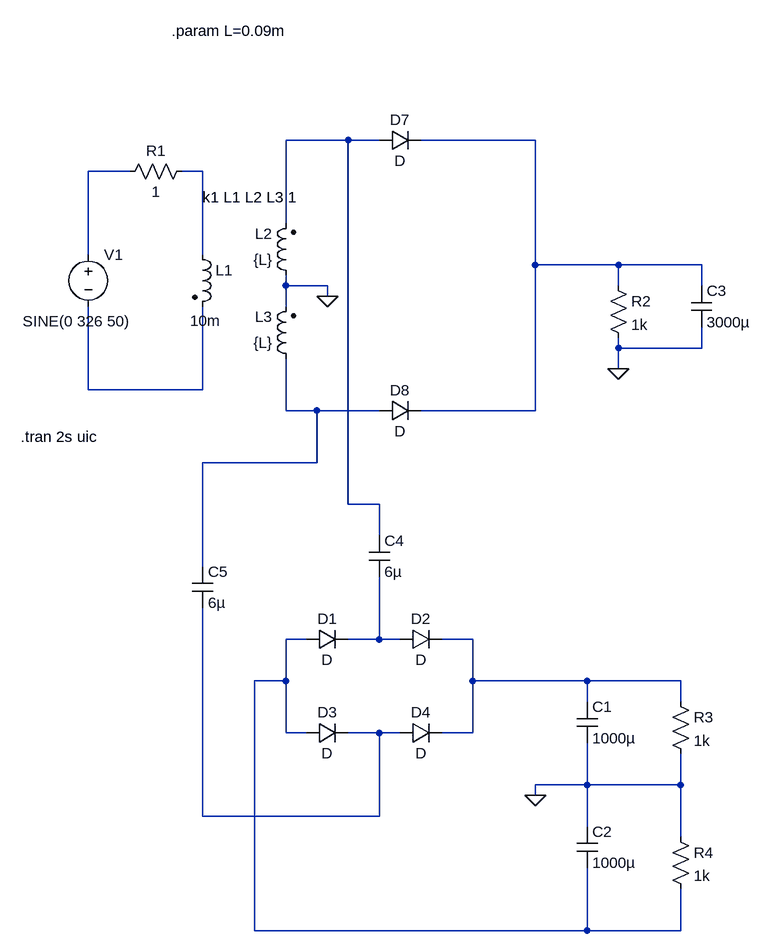
[diagram p0: schematic Dual power supply.asc]
Dual power supply.asc, the LTspice schematic file:
Version 4
SHEET 1 2548 1188
WIRE 304 -48 208 -48
WIRE 352 -48 304 -48
WIRE 592 -48 416 -48
WIRE -32 0 -96 0
WIRE 80 0 48 0
WIRE 208 80 208 -48
WIRE -96 128 -96 0
WIRE 80 128 80 0
WIRE 592 144 592 -48
WIRE 720 144 592 144
WIRE 848 144 720 144
WIRE 208 176 208 160
WIRE 272 176 208 176
WIRE 720 176 720 144
WIRE 848 176 848 144
WIRE 272 192 272 176
WIRE 208 208 208 176
WIRE 720 272 720 256
WIRE 848 272 848 240
WIRE 848 272 720 272
WIRE 720 304 720 272
WIRE -96 336 -96 208
WIRE 80 336 80 208
WIRE 80 336 -96 336
WIRE 208 368 208 288
WIRE 256 368 208 368
WIRE 352 368 256 368
WIRE 592 368 592 144
WIRE 592 368 416 368
WIRE 256 448 256 368
WIRE 256 448 80 448
WIRE 304 512 304 -48
WIRE 352 512 304 512
WIRE 352 560 352 512
WIRE 80 608 80 448
WIRE 240 720 208 720
WIRE 352 720 352 624
WIRE 352 720 304 720
WIRE 384 720 352 720
WIRE 496 720 448 720
WIRE 208 784 208 720
WIRE 208 784 160 784
WIRE 496 784 496 720
WIRE 672 784 496 784
WIRE 816 784 672 784
WIRE 672 816 672 784
WIRE 816 816 816 784
WIRE 208 864 208 784
WIRE 240 864 208 864
WIRE 352 864 304 864
WIRE 384 864 352 864
WIRE 496 864 496 784
WIRE 496 864 448 864
WIRE 672 944 672 880
WIRE 672 944 592 944
WIRE 816 944 816 896
WIRE 816 944 672 944
WIRE 592 960 592 944
WIRE 80 992 80 672
WIRE 352 992 352 864
WIRE 352 992 80 992
WIRE 672 1008 672 944
WIRE 816 1024 816 944
WIRE 160 1168 160 784
WIRE 672 1168 672 1072
WIRE 672 1168 160 1168
WIRE 816 1168 816 1104
WIRE 816 1168 672 1168
FLAG 592 960 0
FLAG 272 192 0
FLAG 720 304 0
SYMBOL ind2 64 112 R0
WINDOW 3 -3 118 Left 2
SYMATTR Value 10m
SYMATTR InstName L1
SYMATTR Type ind
SYMBOL voltage -96 112 R0
WINDOW 3 -101 119 Left 2
WINDOW 123 0 0 Left 0
WINDOW 39 0 0 Left 0
SYMATTR Value SINE(0 326 50)
SYMATTR InstName V1
SYMBOL res 64 -16 R90
WINDOW 0 0 56 VBottom 2
WINDOW 3 32 56 VTop 2
SYMATTR InstName R1
SYMATTR Value 1
SYMBOL diode 240 736 R270
WINDOW 0 32 32 VTop 2
WINDOW 3 0 32 VBottom 2
SYMATTR InstName D1
SYMBOL diode 384 736 R270
WINDOW 0 32 32 VTop 2
WINDOW 3 0 32 VBottom 2
SYMATTR InstName D2
SYMBOL diode 240 880 R270
WINDOW 0 32 32 VTop 2
WINDOW 3 0 32 VBottom 2
SYMATTR InstName D3
SYMBOL diode 384 880 R270
WINDOW 0 32 32 VTop 2
WINDOW 3 0 32 VBottom 2
SYMATTR InstName D4
SYMBOL cap 656 816 R0
SYMATTR InstName C1
SYMATTR Value 1000µ
SYMBOL cap 656 1008 R0
SYMATTR InstName C2
SYMATTR Value 1000µ
SYMBOL ind2 224 176 R180
WINDOW 0 36 80 Left 2
WINDOW 3 36 40 Left 2
SYMATTR InstName L2
SYMATTR Value {L}
SYMATTR Type ind
SYMBOL ind2 224 304 R180
WINDOW 0 36 80 Left 2
WINDOW 3 36 40 Left 2
SYMATTR InstName L3
SYMATTR Value {L}
SYMATTR Type ind
SYMBOL diode 352 -32 R270
WINDOW 0 32 32 VTop 2
WINDOW 3 0 32 VBottom 2
SYMATTR InstName D7
SYMBOL diode 352 384 R270
WINDOW 0 32 32 VTop 2
WINDOW 3 0 32 VBottom 2
SYMATTR InstName D8
SYMBOL res 704 160 R0
SYMATTR InstName R2
SYMATTR Value 1k
SYMBOL cap 832 176 R0
SYMATTR InstName C3
SYMATTR Value 3000µ
SYMBOL res 800 800 R0
SYMATTR InstName R3
SYMATTR Value 1k
SYMBOL res 800 1008 R0
SYMATTR InstName R4
SYMATTR Value 1k
SYMBOL cap 336 560 R0
SYMATTR InstName C4
SYMATTR Value 6µ
SYMBOL cap 64 608 R0
SYMATTR InstName C5
SYMATTR Value 6µ
TEXT 80 40 Left 2 !k1 L1 L2 L3 1
TEXT -200 408 Left 2 !.tran 2s uic
TEXT 32 -216 Left 2 !.param L=0.09m

The netlist it stands for:
* Dual power supply.asc
L1 N004 N005 10m
V1 N003 N005 SINE(0 326 50)
R1 N004 N003 1
D1 N007 N008 D
D2 N008 N009 D
D3 N007 N010 D
D4 N010 N009 D
C1 N009 0 1000µ
C2 0 N007 1000µ
L2 0 N001 {L}
L3 N006 0 {L}
D7 N001 N002 D
D8 N006 N002 D
R2 N002 0 1k
C3 N002 0 3000µ
R3 N009 0 1k
R4 0 N007 1k
C4 N001 N008 6µ
C5 N006 N010 6µ
.model D D
.lib standard.dio
k1 L1 L2 L3 1
.tran 2s uic
.param L=0.09m
.backanno
.end